# EAGLE design 16f628-final (EAGLE 6.2)
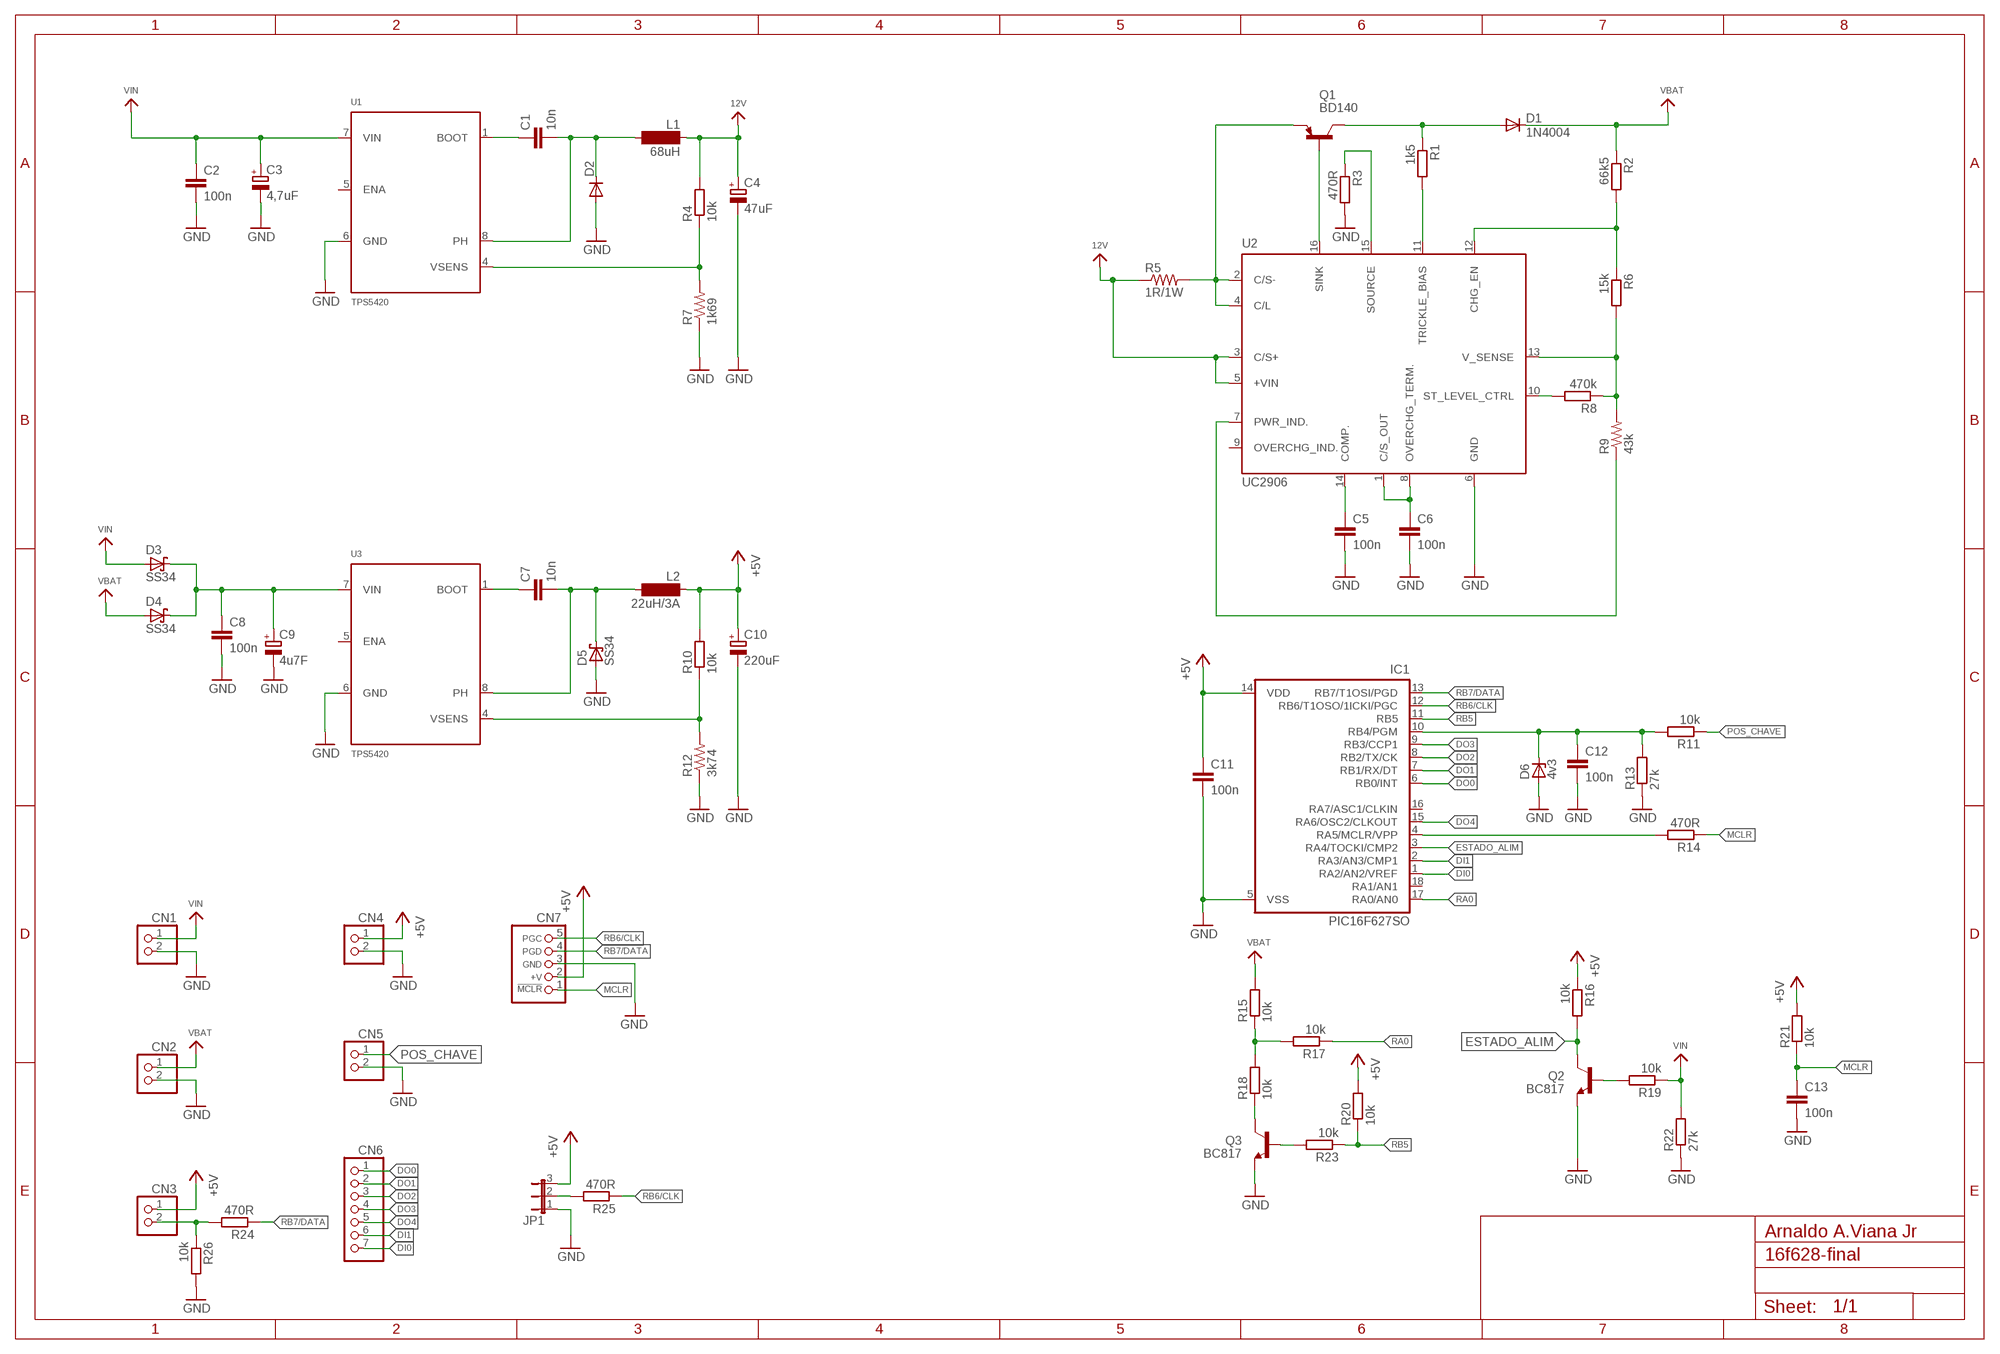
[diagram p0: schematic, sheet 1]

## Parts
C1  10n  C-EUC0805  [C0805]
C2  100n  C-EUC0805  [C0805]
C3  4,7uF  CPOL-EUE2.5-6  [E2,5-6]
C4  47uF  CPOL-EUE2.5-6  [E2,5-6]
C5  100n  C-EUC0805  [C0805]
C6  100n  C-EUC0805  [C0805]
C7  10n  C-EUC0805  [C0805]
C8  100n  C-EUC0805  [C0805]
C9  4u7F  CPOL-EUE2.5-6  [E2,5-6]
C10  220uF  CPOL-EUE2.5-6  [E2,5-6]
C11  100n  C-EUC0805  [C0805]
C12  100n  C-EUC0805  [C0805]
C13  100n  C-EUC0805  [C0805]
CN1  HEADER-1X2ROUND  [1X02_ROUND]
CN2  HEADER-1X2ROUND  [1X02_ROUND]
CN3  HEADER-1X2ROUND  [1X02_ROUND]
CN4  HEADER-1X2ROUND  [1X02_ROUND]
CN5  HEADER-1X2ROUND  [1X02_ROUND]
CN6  HEADER-1X7ROUND  [1X07_ROUND]
CN7  CON_HEADER_PRG_PIC_ICSP0.1INCH_A  [HEADER_PRG_1X05]
D1  1N4004  [DO41-10]
D2  DIODE-SOD123  [SOD123]
D3  SS34  SCHOTTKY-DIODESMC  [SMC]
D4  SS34  SCHOTTKY-DIODESMC  [SMC]
D5  SS34  SCHOTTKY-DIODESMC  [SMC]
D6  4v3  ZENER-DIODESOT23  [SOT23]
IC1  PIC16F627SO  [SO-18W]
JP1  JUMPER3  [JUMPER3]
L1  68uH  SD12K100  [SD12K100]
L2  22uH/3A  SD12K100  [SD12K100]
Q1  BD140  [TO126]
Q2  BC817  BC817-16-NPN-SOT23-BEC  [SOT23-BEC]
Q3  BC817  BC817-16-NPN-SOT23-BEC  [SOT23-BEC]
R1  1k5  R-EU_R0805  [R0805]
R2  66k5  R-EU_R0805  [R0805]
R3  470R  R-EU_R0805  [R0805]
R4  10k  R-EU_R0805  [R0805]
R5  1R/1W  RESISTOR_DUAL  [0805-THM]
R6  15k  R-EU_R0805  [R0805]
R7  1k69  RESISTOR_DUAL  [0805-THM]
R8  470k  R-EU_R0805  [R0805]
R9  43k  RESISTOR_DUAL  [0805-THM]
R10  10k  R-EU_R0805  [R0805]
R11  10k  R-EU_R0805  [R0805]
R12  3k74  RESISTOR_DUAL  [0805-THM]
R13  27k  R-EU_R0805  [R0805]
R14  470R  R-EU_R0805  [R0805]
R15  10k  R-EU_R0805  [R0805]
R16  10k  R-EU_R0805  [R0805]
R17  10k  R-EU_R0805  [R0805]
R18  10k  R-EU_R0805  [R0805]
R19  10k  R-EU_R0805  [R0805]
R20  10k  R-EU_R0805  [R0805]
R21  10k  R-EU_R0805  [R0805]
R22  27k  R-EU_R0805  [R0805]
R23  10k  R-EU_R0805  [R0805]
R24  470R  R-EU_R0805  [R0805]
R25  470R  R-EU_R0805  [R0805]
R26  10k  R-EU_R0805  [R0805]
U1  TPS5420  [SOIC8_150MIL]
U2  UC2906  [SOIC_16]
U3  TPS5420  [SOIC8_150MIL]

## Nets
12V: C4.+ L1.1 R4.2 R5.1 U2.3(C/S+) U2.5(+VIN)
+5V [power]: C10.+ C11.1 CN3.1 CN4.1 CN7.2(+V) IC1.14(VDD) JP1.3 L2.1 R10.2 R16.1 R20.2 R21.2
DI0: CN6.7 IC1.1(RA2/AN2/VREF)
DI1: CN6.6 IC1.2(RA3/AN3/CMP1)
DO0: CN6.1 IC1.6(RB0/INT)
DO1: CN6.2 IC1.7(RB1/RX/DT)
DO2: CN6.3 IC1.8(RB2/TX/CK)
DO3: CN6.4 IC1.9(RB3/CCP1)
DO4: CN6.5 IC1.15(RA6/OSC2/CLKOUT)
ESTADO_ALIM: IC1.3(RA4/TOCKI/CMP2) Q2.C R16.2
GND [power]: C2.2 C3.- C4.- C5.2 C6.2 C8.2 C9.- C10.- C11.2 C12.2 C13.2 CN1.2 CN2.2 CN4.2 CN5.2 CN7.3(GND) D2.A D5.A D6.1(A) IC1.5(VSS) JP1.1 Q2.E Q3.E R3.2 R7.1 R12.1 R13.1 R22.1 R26.2 U1.6(GND) U2.6(GND) U3.6(GND)
MCLR: C13.1 CN7.1(/MCLR) R14.1 R21.1
N$1: C6.1 U2.1(C/S_OUT) U2.8(OVERCHG_TERM.)
N$2: IC1.4(RA5/MCLR/VPP) R14.2
N$3: CN3.2 R24.2 R26.1
N$4: C5.1 U2.14(COMP.)
N$5: R9.1 U2.7(PWR_IND.)
N$6: R3.1 U2.15(SOURCE)
N$7: C7.1 U3.1(BOOT)
N$8: R2.2 R6.1 U2.12(CHG_EN)
N$9: R1.2 U2.11(TRICKLE_BIAS)
N$10: Q1.3(B) U2.16(SINK)
N$11: D1.A Q1.2(C) R1.1
N$12: R6.2 R8.1 R9.2 U2.13(V_SENSE)
N$13: R8.2 U2.10(ST_LEVEL_CTRL)
N$14: C1.1 U1.1(BOOT)
N$15: Q3.B R23.2
N$16: Q3.C R18.1
N$17: Q1.1(E) R5.2 U2.2(C/S-) U2.4(C/L)
N$18: R10.1 R12.2 U3.4(VSENS)
N$19: C7.2 D5.C L2.2 U3.8(PH)
N$20: R4.1 R7.2 U1.4(VSENS)
N$21: JP1.2 R25.2
N$22: C8.1 C9.+ D3.C D4.C U3.7(VIN)
N$23: C1.2 D2.C L1.2 U1.8(PH)
N$24: R15.1 R17.2 R18.2
N$25: C12.1 D6.3(C) IC1.10(RB4/PGM) R11.2 R13.2
N$30: Q2.B R19.2
POS_CHAVE: CN5.1 R11.1
RA0: IC1.17(RA0/AN0) R17.1
RB5: IC1.11(RB5) R20.1 R23.1
RB6/CLK: CN7.5(PGC) IC1.12(RB6/T1OSO/1ICKI/PGC) R25.1
RB7/DATA: CN7.4(PGD) IC1.13(RB7/T1OSI/PGD) R24.1
VBAT: CN2.1 D1.C D4.A R2.1 R15.2
VIN: C2.1 C3.+ CN1.1 D3.A R19.1 R22.2 U1.7(VIN)
Unconnected: IC1.16(RA7/ASC1/CLKIN) IC1.18(RA1/AN1) U1.5(ENA) U2.9(OVERCHG_IND.) U3.5(ENA)

## Notes on the sheet
- Arnaldo A.Viana Jr

## Library data of the parts
C1 C2 C5-C8 C11-C13 = rcl:C-EU: CAPACITOR, European symbol
C3 C4 C9 C10 = rcl:CPOL-EU: POLARIZED CAPACITOR, European symbol
CN1-CN5 = junior:HEADER-1X2: PIN HEADER
CN6 = junior:HEADER-1X7: PIN HEADER
CN7 = dp_devices:CON_HEADER_PRG_PIC_ICSP: 5-pin PIC In Circuit Serial Programming header
D1 = diode:1N4004: DIODE general purpose rectifier, 1 A
D2 = diode:DIODE-: DIODE
D3-D5 = diode:SCHOTTKY-DIODE: Schottky Diode
D6 = diode:ZENER-DIODE: Z-Diode
IC1 = microchip:PIC16*F62: FLASH-Based 8-Bit CMOS Microcontroller Source: http://ww1.microchip.com/downloads/en/DeviceDoc/40300C.pdf; MF: MICROCHIP; MPN: PIC16F627-04/SO; OC_FARNELL: 1084265; OC_NEWARK: 69K7632
JP1 = junior:JUMPER3: JUMPER - 3 Pins
L1 L2 = inductor-neosid:SD12: INDUCTOR nominal inductance; OC_FARNELL: unknown; OC_NEWARK: unknown
Q1 = transistor-pnp:BD140: PNP Transistor
Q2 Q3 = transistor:*-NPN-: NPN Transistror BF959 corrected 2008.03.06
R1-R4 R6 R8 R10 R11 R13-R26 = rcl:R-EU_: RESISTOR, European symbol
R5 R7 R9 R12 = junior:RESISTOR_DUAL: Flip Flop resistor An 0805 resistor inside a standard 1/4W 5% resistor. Makes for easy mods Footprint taken from the Adafruit Industries Eagle Library.
U1 U3 = junior:TPS5420
U2 = junior:UC2906

## Net classes
1 power: width 0.4 mm, drill 0.6 mm, clearance 0.2 mm

## Board
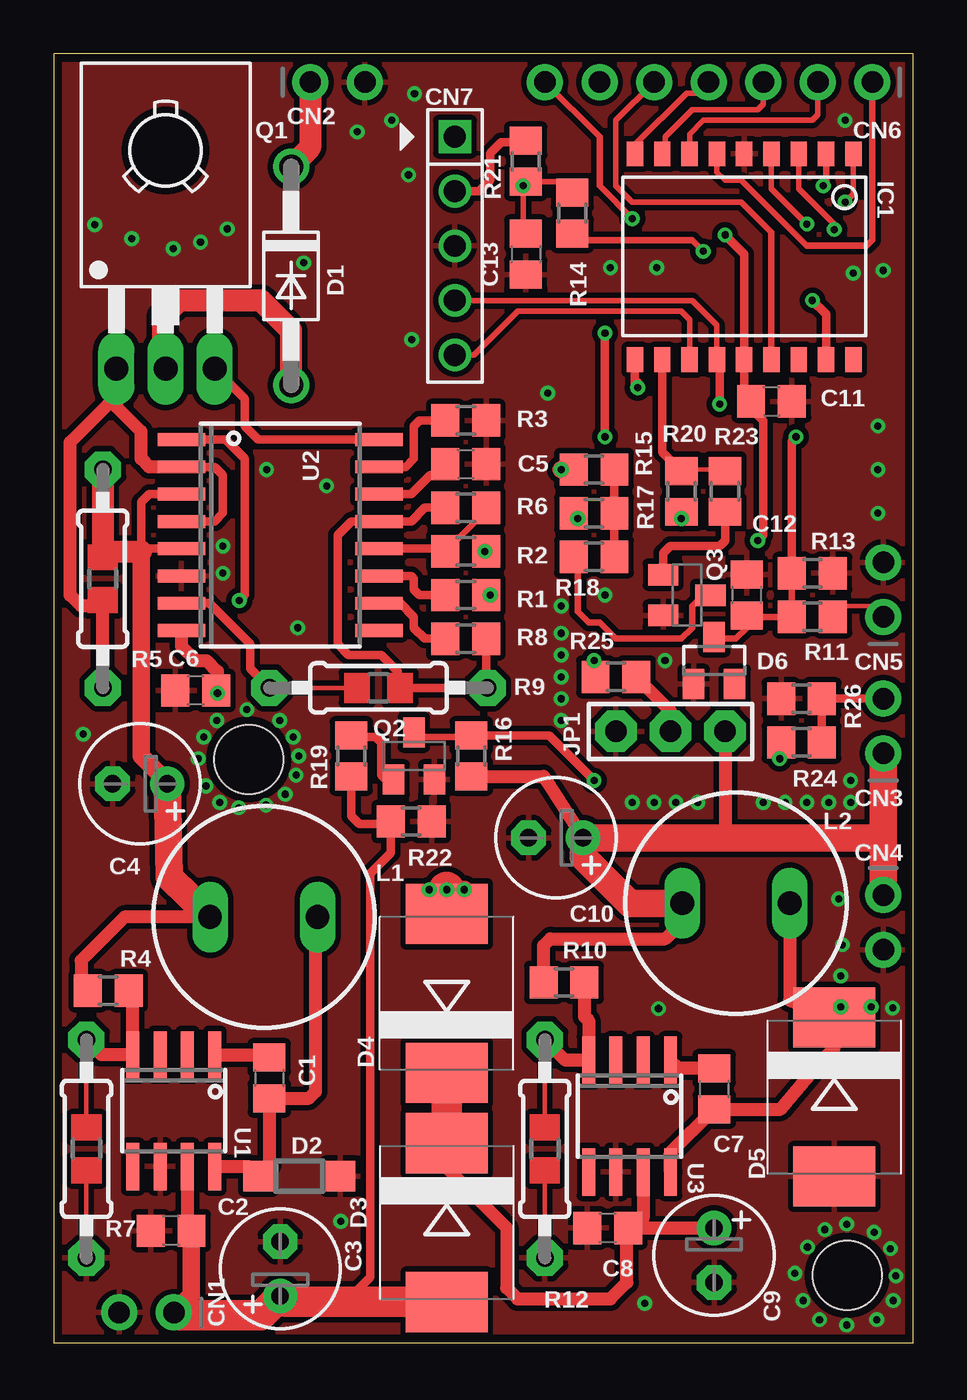
[diagram p1: board, top side]
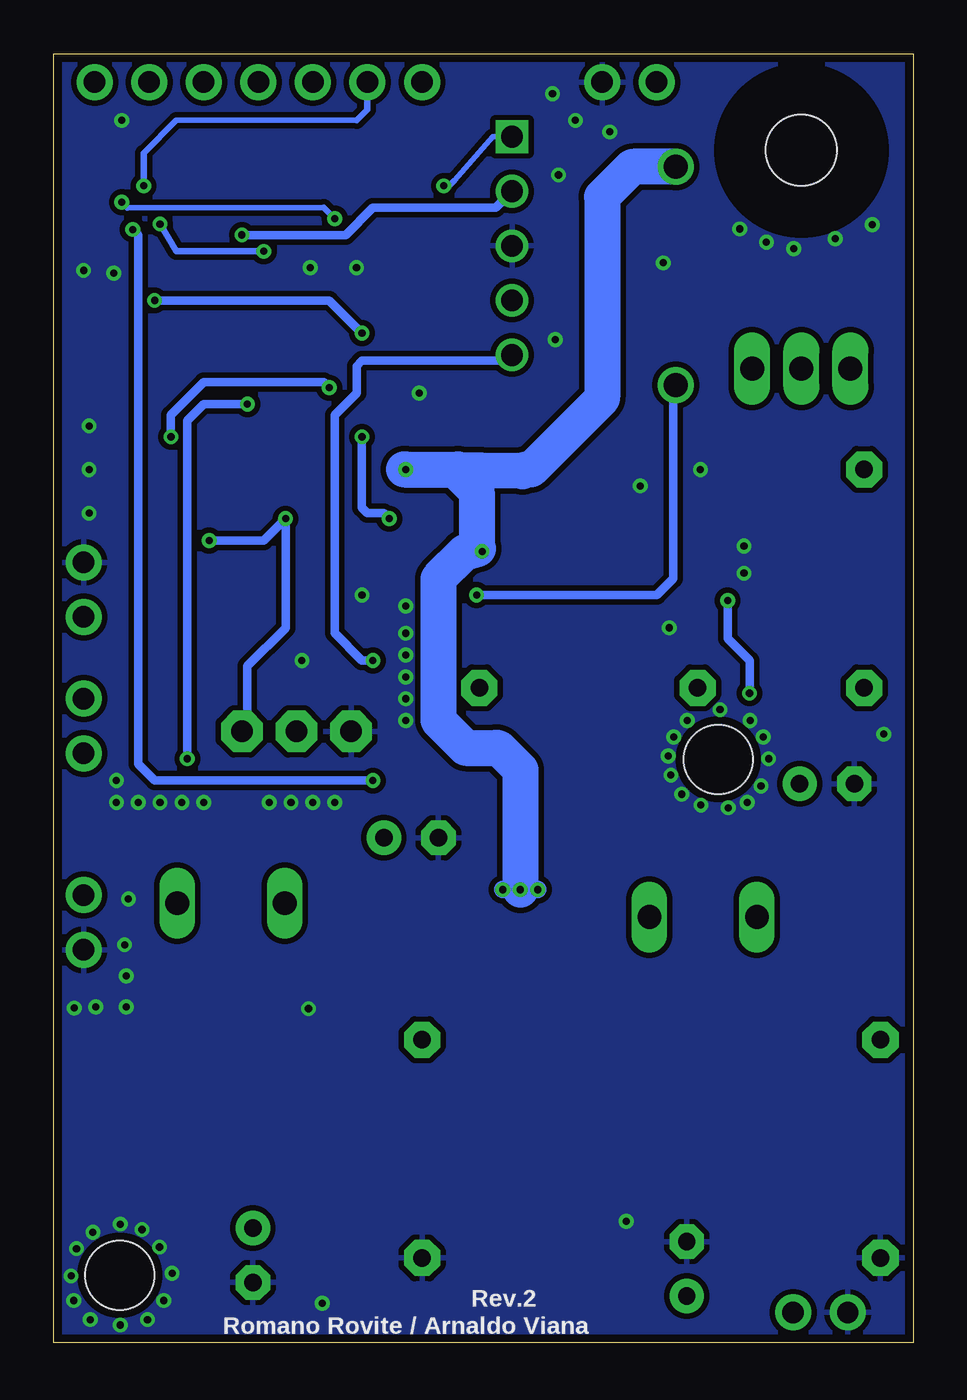
[diagram p2: board, bottom side, seen from below]

Size 40 x 60 mm. Coordinates in mm from the lower left corner, seen from the top.
Outline: 0,0 40,0 40,60 0,60 0,0
Copper layers (1*16): Top 0.0356mm / dielectric 1.5011mm / Bottom 0.0356mm
Design rules: minimum track width 8mil, minimum drill 0.3mm, track to track 6mil, track to pad 6mil, pad to pad 6mil, via to via 6mil, smd to smd 6mil, copper to edge 15mil, drill to drill 6mil, minimum pad ring 7mil, minimum via ring 7mil, stop-mask expansion 4mil, vias tented up to drill 13mil, thermal gap 10mil
Holes 3.2 mm at 36.93,3.12 9.07,27.15

### Footprints (pad centres in the part's own frame; a part is rotated, then mirrored left to right if it is on the bottom)
C0805 = smd 1.3 x 1.5: 1 -0.95,0; 2 0.95,0
E2,5-6 = drill 0.813 pad 1.6: + -1.27,0 | drill 0.813 pad 1.6 octagon: - 1.27,0
1X02_ROUND = drill 1 pad 1.676: 1 -1.27,0; 2 1.27,0
1X07_ROUND = drill 1 pad 1.676: 1 -7.62,0; 2 -5.08,0; 3 -2.54,0; 4 0,0; 5 2.54,0; 6 5.08,0; 7 7.62,0
HEADER_PRG_1X05 = drill 1.016 square: 1 -5.08,0 | drill 1.016: 2 -2.54,0; 3 0,0; 4 2.54,0; 5 5.08,0
DO41-10 = drill 1.118: A 5.08,0; C -5.08,0
SOD123 = smd 1.4 x 1.4: A 1.9,0; C -1.9,0
SMC = smd 2.8 x 3.8: A 3.7,0; C -3.7,0
SOT23 = smd 1 x 1.4: 1 -0.95,-1.1; 2 0.95,-1.1; 3 0,1.1
SO-18W = smd 0.762 x 1.143: 1 -5.08,-4.788; 2 -3.81,-4.788; 3 -2.54,-4.788; 4 -1.27,-4.788; 5 0,-4.788; 6 1.27,-4.788; 7 2.54,-4.788; 8 3.81,-4.788; 9 5.08,-4.788; 10 5.08,4.788; 11 3.81,4.788; 12 2.54,4.788; 13 1.27,4.788; 14 0,4.788; 15 -1.27,4.788; 16 -2.54,4.788; 17 -3.81,4.788; 18 -5.08,4.788
JUMPER3 = drill 1 pad 1.93 octagon: 1 -2.54,0; 2 0,0; 3 2.54,0
SD12K100 = drill 1.1 long: 1 -2.5,0; 2 2.5,0
TO126 = drill 1.118 long: 1 -2.286,-5.08; 2 0,-5.08; 3 2.286,-5.08 | hole 3.302: 0,5.08
SOT23-BEC = smd 1 x 1.4: B -0.95,-1.1; C 0,1.1; E 0.95,-1.1
R0805 = smd 1.3 x 1.5: 1 -0.95,0; 2 0.95,0
0805-THM = drill 0.813 pad 1.676 octagon: 1 -5.08,0; 2 5.08,0
SOIC8_150MIL = smd 0.6 x 2.2: 1 -1.905,-2.6; 2 -0.635,-2.6; 3 0.635,-2.6; 4 1.905,-2.6; 5 1.905,2.6; 6 0.635,2.6; 7 -0.635,2.6; 8 -1.905,2.6
SOIC_16 = smd 0.6 x 2.2: 1 -4.445,-4.6; 2 -3.175,-4.6; 3 -1.905,-4.6; 4 -0.635,-4.6; 5 0.635,-4.6; 6 1.905,-4.6; 7 3.175,-4.6; 8 4.445,-4.6; 9 4.445,4.6; 10 3.175,4.6; 11 1.905,4.6; 12 0.635,4.6; 13 -0.635,4.6; 14 -1.905,4.6; 15 -3.175,4.6; 16 -4.445,4.6

### Placement (x,y rotation side)
C1  10.03,12.32 270 top
C2  5.46,5.21 180 top
C3  10.54,3.43 90 top
C4  4.01,26.01 180 top
C5  19.18,40.89 0 top
C6  6.6,30.35 180 top
C7  30.73,11.81 270 top
C8  25.78,5.33 180 top
C9  30.73,4.06 270 top
C10  23.37,23.5 180 top
C11  33.4,43.81 0 top
C12  32.26,34.8 90 top
C13  21.97,50.67 270 top
CN1  4.32,1.4 180 top
CN2  13.21,58.67 0 top
CN3  38.61,28.7 90 top
CN4  38.61,19.56 270 top
CN5  38.61,35.05 90 top
CN6  30.48,58.67 180 top
CN7  18.67,51.05 270 top
D1  11.05,49.66 270 top
D2  11.43,7.75 0 top
D3  18.29,5.59 270 top
D4  18.29,16.26 90 top
D5  36.32,11.43 270 top
D6  30.73,31.75 0 top
IC1  32.13,50.55 180 top
JP1  28.7,28.45 0 top
L1  9.78,19.81 0 top
L2  31.75,20.45 0 top
Q1  5.21,50.42 0 top
Q2  16.76,27.3 0 top
Q3  29.46,34.8 270 top
R1  19.18,34.8 180 top
R2  19.18,36.83 180 top
R3  19.18,42.93 0 top
R4  2.54,16.38 180 top
R5  2.29,35.56 270 top
R6  19.18,38.86 180 top
R7  1.52,9.02 90 top
R8  19.18,32.77 180 top
R9  15.11,30.48 0 top
R10  23.75,16.76 180 top
R11  35.31,33.78 180 top
R12  22.86,9.02 90 top
R13  35.31,35.81 180 top
R14  24.13,52.58 270 top
R15  25.15,40.64 180 top
R16  19.43,27.3 90 top
R17  25.15,38.61 0 top
R18  25.15,36.58 0 top
R19  13.84,27.3 90 top
R20  29.21,39.62 270 top
R21  21.97,54.99 90 top
R22  16.64,24.26 180 top
R23  31.24,39.62 270 top
R24  34.8,27.94 0 top
R25  26.16,30.99 0 top
R26  34.8,29.97 180 top
U1  5.59,10.79 180 top
U2  10.54,37.59 270 top
U3  26.8,10.54 180 top

### Tracks (layer width: path | path; a pad name or v marks a point on that pad's centre or on a via)
12V
  Top 0.406: U2.3 4.45,39.5 4.06,39.12 4.06,36.83 3.94,36.96 U2.5
  Top 0.61: L1.1 3.3,19.81 1.27,17.78 1.27,16.7 R4.2
  Top 0.813: C4.+ 5.21,26.16 4.06,27.3 4.06,36.83 3.81,36.83
  Top 1.016: R5.1 2.29,36.83 | 2.29,36.58 2.29,36.83 | 2.29,36.83 4.06,36.83
  Top 1.27: L1.1 5.37,21.68 C4.+
+5V  (via drill 0.33)
  Top 0.254: 21.91,55.88 R21.2
  Top 0.406: CN7.2 19.81,53.59 20.32,54.1 20.32,55.37 20.83,55.88 21.91,55.88 | v31.24,51.56 32.13,50.67 IC1.14 32.13,44.13 C11.1 32.45,43.49 33.02,42.93 33.02,37.59 v32.77,37.34 | R20.2 v29.21,38.35
  Top 0.61: R10.2 22.8,18.48 23.11,18.8 28.45,18.8 29.21,19.56 L2.1 | 24.68,23.5 C10.+ 22.79,26.36 R16.1 | JP1.3 31.24,23.5
  Top 1.27: L2.1 26.8,20.45 24.64,22.61 24.68,23.5 31.24,23.5 38.48,23.5 38.61,23.37 | CN3.1 38.61,23.37 | 38.61,23.37 CN4.1
  Bottom 0.406: v31.24,51.56 26.42,51.56 25.15,52.83 19.43,52.83 CN7.2 | JP1.3 30.99,28.7 30.99,31.5 29.21,33.27 v29.21,38.35 30.23,37.34 v32.77,37.34
DI0  (via drill 0.33)
  Top 0.254: IC1.1 37.21,53.47 v36.83,53.09
  Top 0.305: CN6.7 25.4,56.13 25.4,53.85 v26.92,52.32
  Bottom 0.254: 27.43,52.83 36.58,52.83
  Bottom 0.305: v26.92,52.32 27.43,52.83 | v36.83,53.09 36.58,52.83
DI1  (via drill 0.33)
  Top 0.305: IC1.2 35.94,53.98 v35.81,53.85
  Bottom 0.254: 25.91,56.9 34.29,56.9 35.81,55.37
  Bottom 0.305: CN6.6 25.4,57.4 25.91,56.9 | v35.81,53.85 35.81,55.37
DO0
  Top 0.254: IC1.6 30.86,54.48 31.24,54.1 32,54.1 35.05,51.05
  Top 0.305: 35.05,51.05 37.85,51.05 38.1,51.31 CN6.1
DO1
  Top 0.254: IC1.7 29.59,56.26 30.23,56.9 35.31,56.9 35.56,57.15 CN6.2
DO2
  Top 0.254: CN6.3 33.02,57.66 32.77,57.4 29.72,57.4 28.45,56.13 28.45,55.46
  Top 0.305: 28.45,55.46 IC1.8
DO3
  Top 0.254: IC1.9 27.05,55.75 29.46,58.17 29.97,58.17 CN6.4
DO4
  Top 0.254: 33.4,51.69 32,53.09 26.92,53.09 26.16,53.85 26.16,56.9 CN6.5
  Top 0.305: IC1.15 33.4,51.69
ESTADO_ALIM  (via drill 0.33)
  Top 0.203: 16.76,28.19 Q2.C | 19.3,28.19 R16.2
  Top 0.254: v36.32,51.82 36.32,52.07 34.67,53.72 IC1.3
  Top 0.305: 19.3,28.19 16.76,28.19
  Top 0.406: R16.2 23.05,28.25 v25.15,26.16
  Bottom 0.406: v25.15,26.16 35.31,26.16 36.07,26.92 36.07,51.56 v36.32,51.82
GND  (via drill 0.33)
  other vias: 16.51,54.36 36.83,56.9 38.35,42.67 12.7,39.88 38.35,40.64 22.99,44.2 38.35,38.61 28.45,31.75 25.65,34.8 23.62,33.02 23.62,32 23.62,30.99 23.62,29.97 23.62,28.96 23.62,34.29 37.08,26.16 37.08,25.15 36.07,25.15 35.05,25.15 34.04,25.15 33.02,25.15 29.97,25.15 28.96,25.15 27.94,25.15 26.92,25.15 9.91,40.64 28.07,50.04 6.99,28.19 6.73,27.18 7.87,37.08 7.87,35.81 8.08,51.84 1.91,52.04 3.63,51.38 5.56,50.93 6.83,51.23 14.12,56.36 15.72,56.9 16.79,58.14 16.66,46.69 11.63,50.27 11.35,33.27 36.53,20.65 36.7,18.52 36.63,17.07 36.63,15.62 38.05,15.62 39.04,15.57 35.08,4.45 13.36,5.64 27.51,1.83 11.4,27.3 11.15,28.19 7.72,25.15 9.88,25.02 10.77,25.53 7.09,25.91 11.28,26.42 8.99,29.46 10.52,28.96 8.61,24.89 1.37,28.32 7.59,28.96 38.94,4.37 39.07,1.96 34.87,1.96 34.49,3.23 35.89,5.26 36.91,5.51 38.18,5.13 39.19,3.1 38.3,1.07 35.64,1.07 36.91,0.81 28.14,15.54 25.91,50.04 37.21,49.78 38.61,49.91
  pour Top (isolate 0.254, rank 3): -0.23,60.25 -0.25,0 -0.25,-0.25 40.13,-0.25 40.13,59.94 39.88,60.2
  pour Bottom (isolate 0.254, rank 3): -0.15,60.3 -0.25,0 -0.25,-0.25 40.13,-0.25 40.13,59.94 39.88,60.2
MCLR  (via drill 0.33)
  Top 0.254: R14.1 23.62,54.04 R21.1 21.84,53.91 v21.84,53.85 21.84,51.75 C13.1
  Bottom 0.254: CN7.1 19.56,56.13 21.34,54.1 21.59,53.85 v21.84,53.85
N$1  (via drill 0.33)
  Top 0.406: U2.1 8,42.04 8.89,41.15 8.89,34.8 v8.64,34.54
  Top 0.61: U2.8 5.94,32.41 6.6,31.75 7.11,31.75 7.62,31.24 v7.62,30.23 7.87,29.91 C6.1
  Bottom 0.406: v8.64,34.54 8.64,32.77 7.62,31.75 v7.62,30.23
N$2  (via drill 0.33)
  Top 0.254: v35.05,52.07 33.4,53.72 IC1.4
  Top 0.305: R14.2 24.32,51.63 24.64,51.31 29.72,51.31 v30.23,50.8
  Bottom 0.305: v30.23,50.8 34.29,50.8 v35.05,52.07
N$3
  Top 0.406: CN3.2 R26.1 R24.2
N$4
  Top 0.406: C5.1 18.23,40.83 17.78,40.39 17.53,40.39 16.64,39.5 U2.14
N$5
  Top 0.406: U2.7 7.24,34.42 9.14,32.51 9.14,31.37 R9.1
N$6
  Top 0.406: U2.15 16.38,40.77 16.76,41.15 16.76,42.67 17.02,42.93 R3.1
N$7
  Top 0.61: C7.1 29.08,12.76 U3.1
N$8
  Top 0.254: 20.13,38.73 R2.2
  Top 0.406: U2.12 18.1,36.96 R2.2 | R6.1 20.13,38.73
N$9
  Top 0.406: U2.11 16.64,35.69 16.76,35.56 16.76,35.05 17.02,34.8 R1.2
N$10
  Top 0.406: U2.16 9.53,42.04 8.89,42.67 8.89,43.94 Q1.3
N$11  (via drill 0.33)
  Top 0.406: R1.1 v20.32,34.8
  Top 1.016: D1.A 11.05,47.12 9.65,48.51 5.84,48.51 5.08,47.75 5.08,45.47 Q1.2
  Bottom 0.406: v20.32,34.8 11.94,34.8 11.18,35.56 11.18,44.45 D1.A
N$12
  Top 0.406: R6.2 17.27,38.86 16.64,38.23 U2.13 13.84,38.23 13.21,37.59 13.21,32.51 13.72,32 15.24,32 16,31.24 16,30.73 16.26,30.48 R9.2 20.13,30.55 R8.1
N$13
  Top 0.406: U2.10 16.13,34.42 16.76,33.78 16.76,33.27 17.27,32.77 R8.2
N$14
  Top 0.61: U1.1 9.91,13.39 C1.1
N$15
  Top 0.406: Q3.B 28.36,36.75 28.7,37.08 30.99,37.08 31.24,37.34 R23.2
N$16
  Top 0.305: Q3.C 30.23,34.8 29.72,34.29 29.72,33.27 29.21,32.77 26.16,32.77 25.4,33.53 24.89,33.53 24.38,34.04 24.38,36.39 R18.1
N$17
  Top 0.406: U2.2 7.49,40.77 7.87,40.39 7.87,38.61 7.49,38.23 U2.4
  Top 0.61: R5.2 2.29,34.29 1.27,34.29 0.76,34.8 0.76,41.91 2.92,44.07 2.92,43.56 4.06,42.42 4.06,41.15 4.45,40.77 U2.2
  Top 0.813: Q1.1 2.92,44.07
N$18
  Top 0.61: R12.2 23.82,13.14 U3.4 24.89,14.99 24.7,15.18 R10.1
N$19
  Top 0.61: U3.8 28.7,8.83 C7.2 33.83,10.86 35.81,13.21 36.32,13.72 D5.C 34.25,15.93 L2.2
N$20
  Top 0.61: R4.1 3.68,16.19 U1.4 2.23,13.39 R7.2
N$21
  Top 0.61: JP1.2 28.7,29.4 R25.2
N$22
  Top 0.61: C8.1 C9.+ | U3.7 27.43,5.78 C8.1 | D3.C 18.29,8.13 21.08,5.33 21.08,2.54 21.59,2.03 25.91,2.03 26.67,2.79 26.67,5.02 C8.1
  Top 1.422: D4.C D3.C
N$23
  Top 0.61: U1.8 9.08,8.2 D2.C 10.03,8.25 C1.2 11.88,11.37 12.19,11.68 12.19,19.73 L1.2
N$24
  Top 0.406: R18.2 R17.2 R15.1
N$25  (via drill 0.33)
  Top 0.305: R13.2 R11.2 32.32,33.78 C12.1 32.26,33.27 31.75,32.77 30.82,32.77 D6.3
  Top 0.406: R13.2 34.36,41.98 v34.54,42.16 | 27.18,44.7 v27.18,44.45 27.05,44.58 IC1.10
  Bottom 0.406: v34.54,42.16 34.54,43.18 33.02,44.7 27.43,44.7 v27.18,44.45
N$30
  Top 0.406: Q2.B 15.45,26.2 15.24,26.42 15.24,27.94 14.99,28.19 13.9,28.19 R19.2
POS_CHAVE
  Top 0.203: R11.1 36.83,34.29 38.1,34.29 CN5.1
RA0  (via drill 0.33)
  Top 0.406: R17.1 24.2,38.54 v24.38,38.35 | IC1.17 35.94,47.88 v35.31,48.51 | v25.65,46.99 v25.65,42.16
  Bottom 0.406: v35.31,48.51 27.18,48.51 v25.65,46.99 | v25.65,42.16 25.65,38.86 25.4,38.61 24.64,38.61 v24.38,38.35
RB5
  Top 0.203: R20.1 29.21,40.64 31.75,40.64 R23.1
  Top 0.406: IC1.11 28.32,41.46 R20.1
RB6/CLK  (via drill 0.33)
  Top 0.254: CN7.5 19.56,45.97 21.59,48.01 29.21,48.01 29.59,47.62 IC1.12
  Top 0.406: R25.1 25.21,31.68 v25.15,31.75
  Bottom 0.406: v25.15,31.75 25.65,31.75 26.92,33.02 26.92,43.18 25.91,44.2 25.91,45.47 25.65,45.72 18.92,45.72 CN7.5
RB7/DATA  (via drill 0.33)
  Top 0.254: CN7.4 29.72,48.51 30.86,47.37 IC1.13
  Top 0.406: R24.1 33.85,27.24 v33.78,27.18 | v30.99,43.69 30.99,45.63 IC1.13
  Bottom 0.406: v33.78,27.18 33.78,42.93 33.02,43.69 v30.99,43.69
VBAT  (via drill 0.33)
  Top 0.813: R15.2 v23.62,40.64 | v20.07,36.83 R2.1 | 19.05,21.08 v19.1,21.08 v18.29,21.08
  Top 1.016: 11.18,54.86 D1.C 11.94,55.63 CN2.1
  Top 1.676: v18.29,21.08 D4.A
  Bottom 0.813: 20.64,36.83 v20.07,36.83 | v19.1,21.08 v17.48,21.08
  Bottom 1.676: D1.C 12.98,54.74 arc-45 13.15,54.66 14.48,53.34 14.48,44.05 arc45 14.55,43.87 17.78,40.64 18,40.64 arc-45 18.17,40.57 23.69,40.64 v23.62,40.64 21.19,40.64 arc45 21.26,40.57 20.32,39.62 20.32,37.13 arc-45 20.25,36.95 20.64,36.83 20.72,36.83 arc-45 20.9,36.76 22.1,35.56 22.1,29.06 arc-45 22.02,28.88 20.83,27.69 19.41,27.69 arc45 19.23,27.61 18.29,26.67 v18.29,21.08
VIN
  Top 0.406: R19.1 13.84,24.51 14.22,24.13 15.56,24.13 R22.2 15.69,22.8 14.73,21.84 14.73,3.03 13.59,1.89 | 5.87,1.27 CN1.1
  Top 0.61: U1.7 6.22,5.39 C2.1
  Top 0.813: C2.1 6.41,2.22 CN1.1
  Top 1.422: 5.87,1.27 9.65,1.27 C3.+ 10.81,1.89 13.59,1.89 D3.A

### Text on the board
bNames: Rev.2 | Romano Rovite / Arnaldo Viana